# EAGLE design board-beta.0.7 (EAGLE 7.7.0)
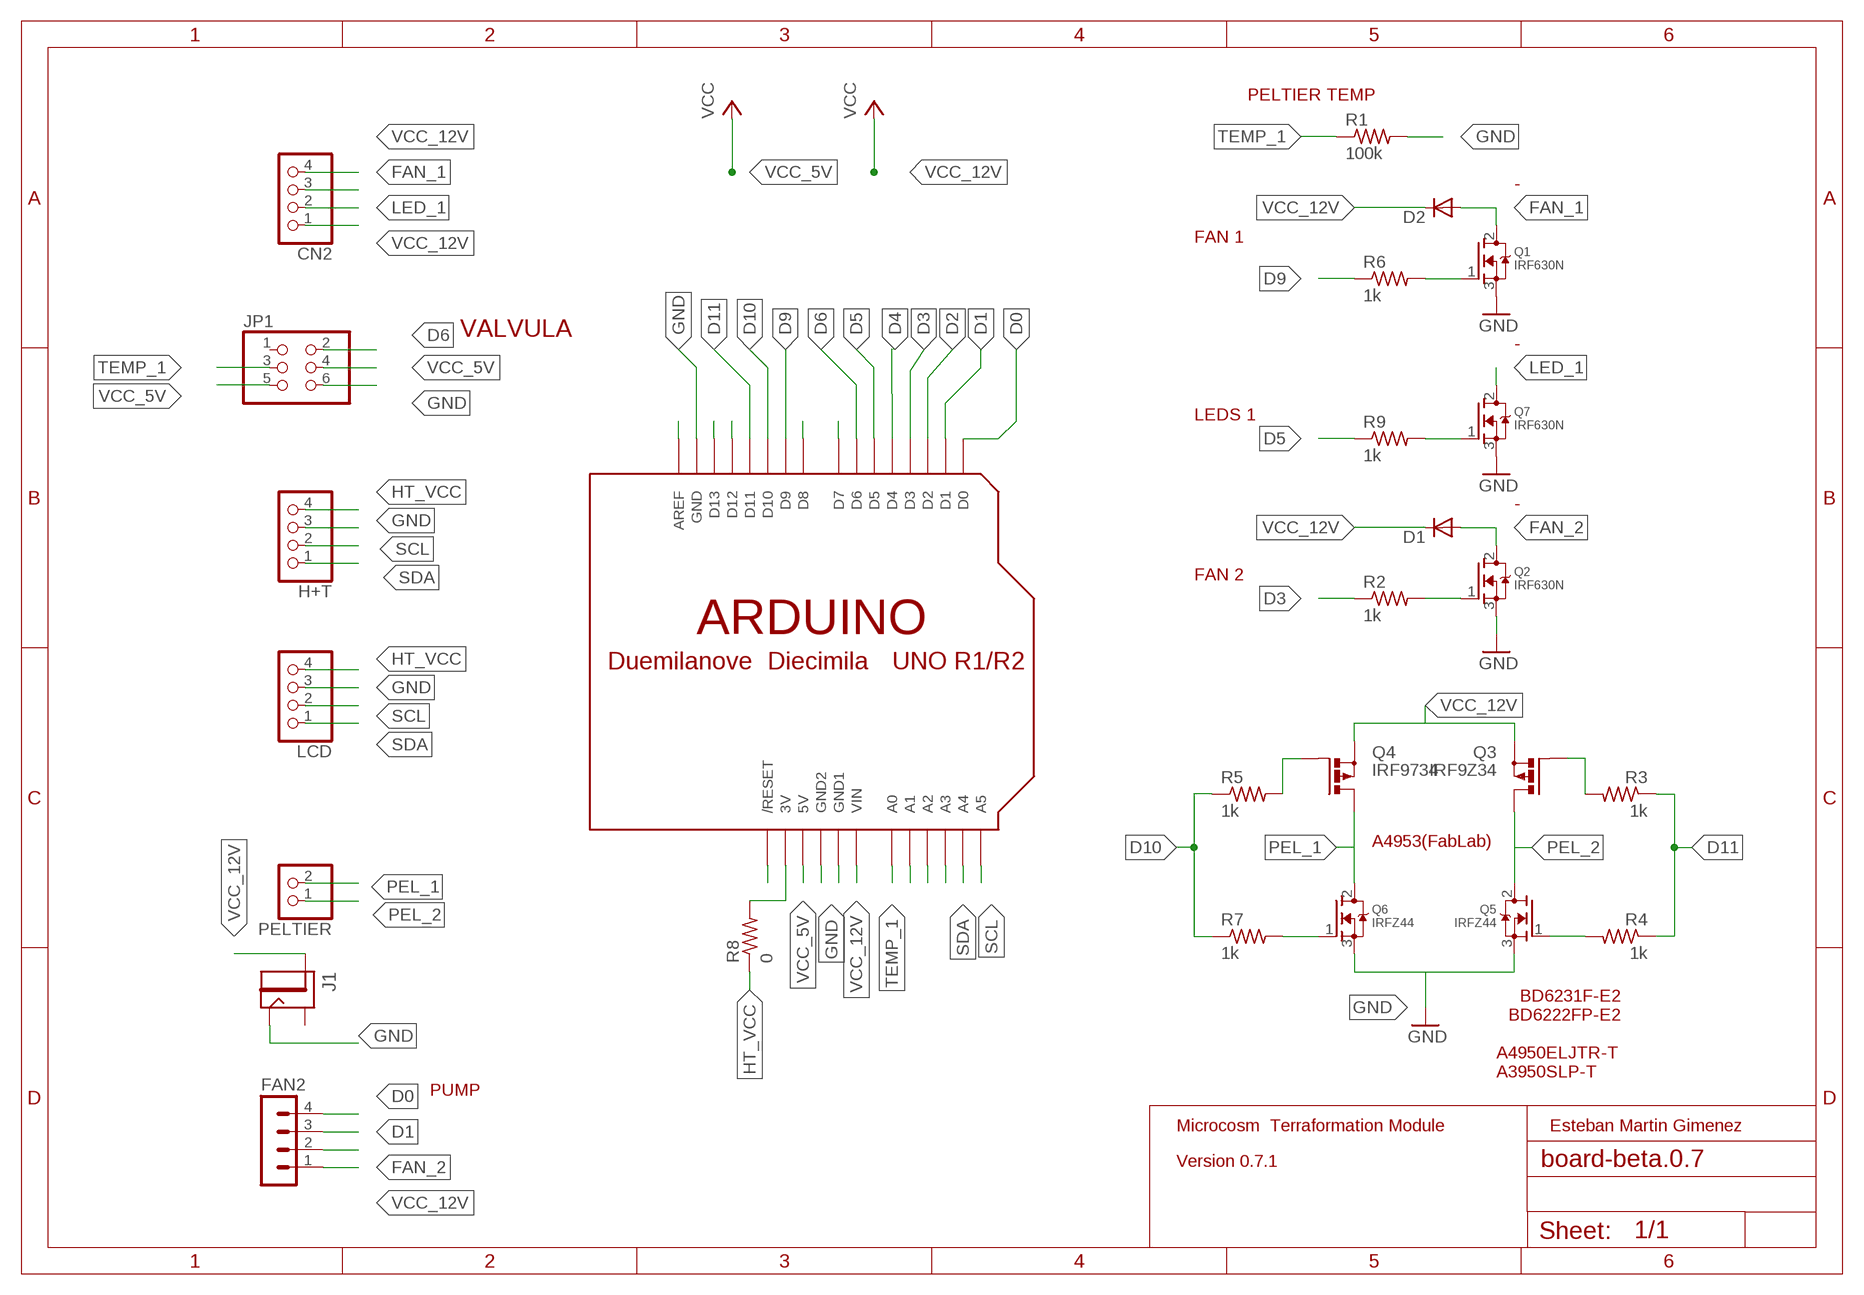
[diagram p0: schematic, sheet 1]

## Parts
CN2  PINHD-1X4  [1X04]
D1  DIODESOD123  [SOD123]
D2  DIODESOD123  [SOD123]
FAN2  MA04-1  [MA04-1]
H+T  PINHD-1X4  [1X04]
J1  JACK2.1MM  [JACK_2.1MM]
JP1  PINHD-2X3-SMD  [2X03SMD]
LCD  PINHD-1X4  [1X04]
PELTIER  PINHD-1X2  [1X02]
Q1  IRF630N  MOSFET-NGDS_TO220V  [TO220V]
Q2  IRF630N  MOSFET-NGDS_TO220V  [TO220V]
Q3  IRF9Z34  PMOSFET_PTO220BV  [TO220BV]
Q4  IRF9734  PMOSFET_PTO220BV  [TO220BV]
Q5  IRFZ44  MOSFET-NGDS_TO220V  [TO220V]
Q6  IRFZ44  MOSFET-NGDS_TO220V  [TO220V]
Q7  IRF630N  MOSFET-NGDS_TO220V  [TO220V]
R1  100k  RES-US1206FAB  [R1206FAB]
R2  1k  RES-US1206FAB  [R1206FAB]
R3  1k  RES-US1206FAB  [R1206FAB]
R4  1k  RES-US1206FAB  [R1206FAB]
R5  1k  RES-US1206FAB  [R1206FAB]
R6  1k  RES-US1206FAB  [R1206FAB]
R7  1k  RES-US1206FAB  [R1206FAB]
R8  0  RES-US1206FAB  [R1206FAB]
R9  1k  RES-US1206FAB  [R1206FAB]
U$1  ARDUINOUNO  [ARDUINO]

## Nets
D0: FAN2.4 U$1.D0
D1: FAN2.3 U$1.D1
D2: U$1.D2
D3: R2.1 U$1.D3
D4: U$1.D4
D5: R9.1 U$1.D5
D6: JP1.2 U$1.D6
D9: R6.1 U$1.D9
D10: R5.1 R7.1 U$1.D10
D11: R3.1 R4.1 U$1.D11
FAN_1: CN2.3 D2.ANODE(A) Q1.2(D)
FAN_2: D1.ANODE(A) FAN2.2 Q2.2(D)
GND: H+T.3 J1.CONTACT JP1.6 LCD.3 Q1.3(S) Q2.3(S) Q5.3(S) Q6.3(S) Q7.3(S) R1.2 U$1.GND U$1.GND2
HT_VCC: H+T.4 LCD.4 R8.1
LED_1: CN2.2 Q7.2(D)
N$1: Q1.1(G) R6.2
N$3: Q4.G R5.2
N$4: U$1.D8
N$5: Q3.G R3.2
N$7: R8.2 U$1.3V
N$8: U$1.D7
N$9: Q5.1(G) R4.2
N$10: Q6.1(G) R7.2
N$11: Q2.1(G) R2.2
N$12: Q7.1(G) R9.2
N$13: U$1.D12
N$14: U$1.D13
N$16: U$1.AREF
N$19: U$1.A3
N$20: U$1.A2
N$21: U$1.A1
N$24: U$1.GND1
N$28: U$1.RESET(/RESET)
PEL_1: PELTIER.2 Q4.D Q6.2(D)
PEL_2: PELTIER.1 Q3.D Q5.2(D)
SCL: H+T.2 LCD.2 U$1.A5
SDA: H+T.1 LCD.1 U$1.A4
TEMP_1: JP1.3 R1.1 U$1.A0
VCC_5V: JP1.4 JP1.5 U$1.5V ; supply symbol labelled VCC
VCC_12V: CN2.1 CN2.4 D1.CATHODE(C) D2.CATHODE(C) FAN2.1 J1.PIN Q3.S Q4.S U$1.VIN ; supply symbol labelled VCC
Unconnected: J1.SHUNT JP1.1

## Notes on the sheet
- PELTIER TEMP
- -
- FAN 1
- VALVULA
- -
- LEDS 1
- -
- FAN 2
- A4953(FabLab)
- BD6231F-E2
  BD6222FP-E2
- PUMP
- A4950ELJTR-T
  A3950SLP-T
- Microcosm  Terraformation Module | Esteban Martin Gimenez
- Version 0.7.1

## Library data of the parts
CN2 H+T LCD = pinhead:PINHD-1X4: PIN HEADER
D1 D2 = fab:DIODE: DIODE high speed (Philips)
FAN2 = con-lstb:MA04-1: PIN HEADER; OC_FARNELL: unknown; OC_NEWARK: unknown
J1 = fab:JACK
JP1 = fab:PINHD-2X3-SMD: PIN HEADER
PELTIER = pinhead:PINHD-1X2: PIN HEADER
Q1 Q2 Q5-Q7 = adafruit:MOSFET-N: N-Channel Mosfet 2N7002E - 60V 260mA SOT23 [Digikey: 2N7002ET1GOSTR-ND] - REEL BSH103 - 30V 850mA SOT23 [Digikey: 568-5013-1-ND]
Q3 Q4 = transistor-power:PMOSFET_P: Power MOSFET P-Channel
R1-R9 = fab:RES-US: Resistor (US Symbol) Variants with postfix FAB are widened to allow the routing of internal traces
U$1 = adafruit:ARDUINO: Arduino Diecimila/Duemilanove Make a shield with ease, this package has all the named pins as well as the two mounting drill holes and an outline of the USB and DC power connector. The outline is on the DIMENSION layer, so if your board house uses it they will cut the outline to match. http://www.ladyada.net/library/pcb/eaglelibrary.html

## Board
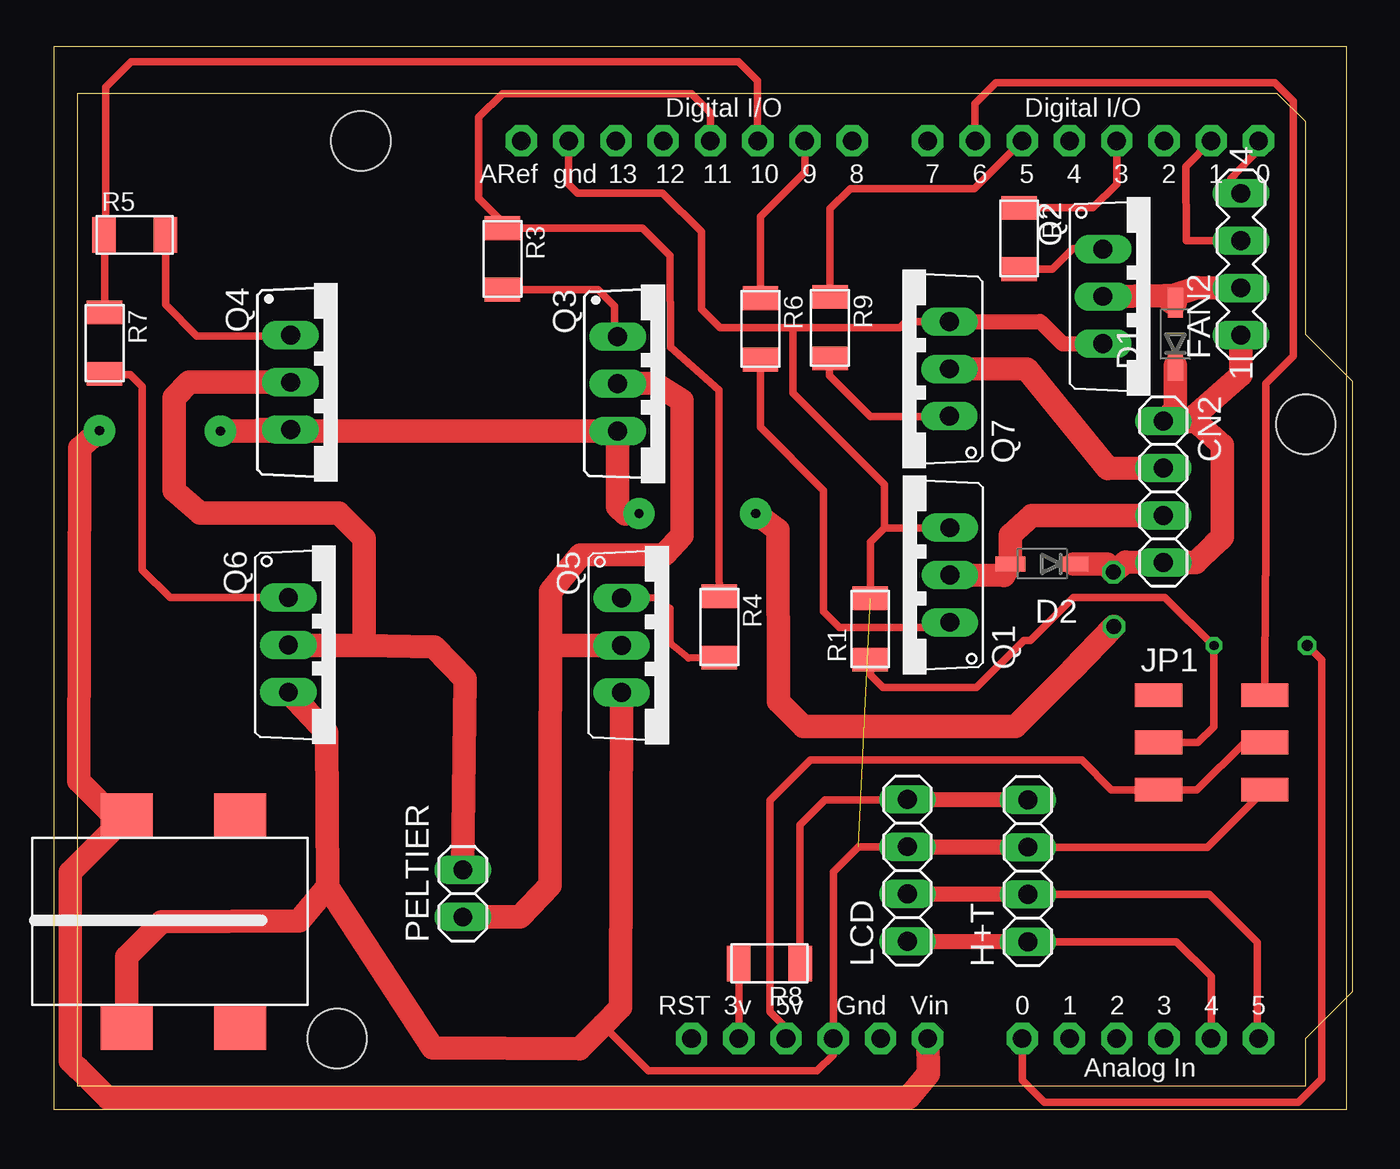
[diagram p1: board, top side]
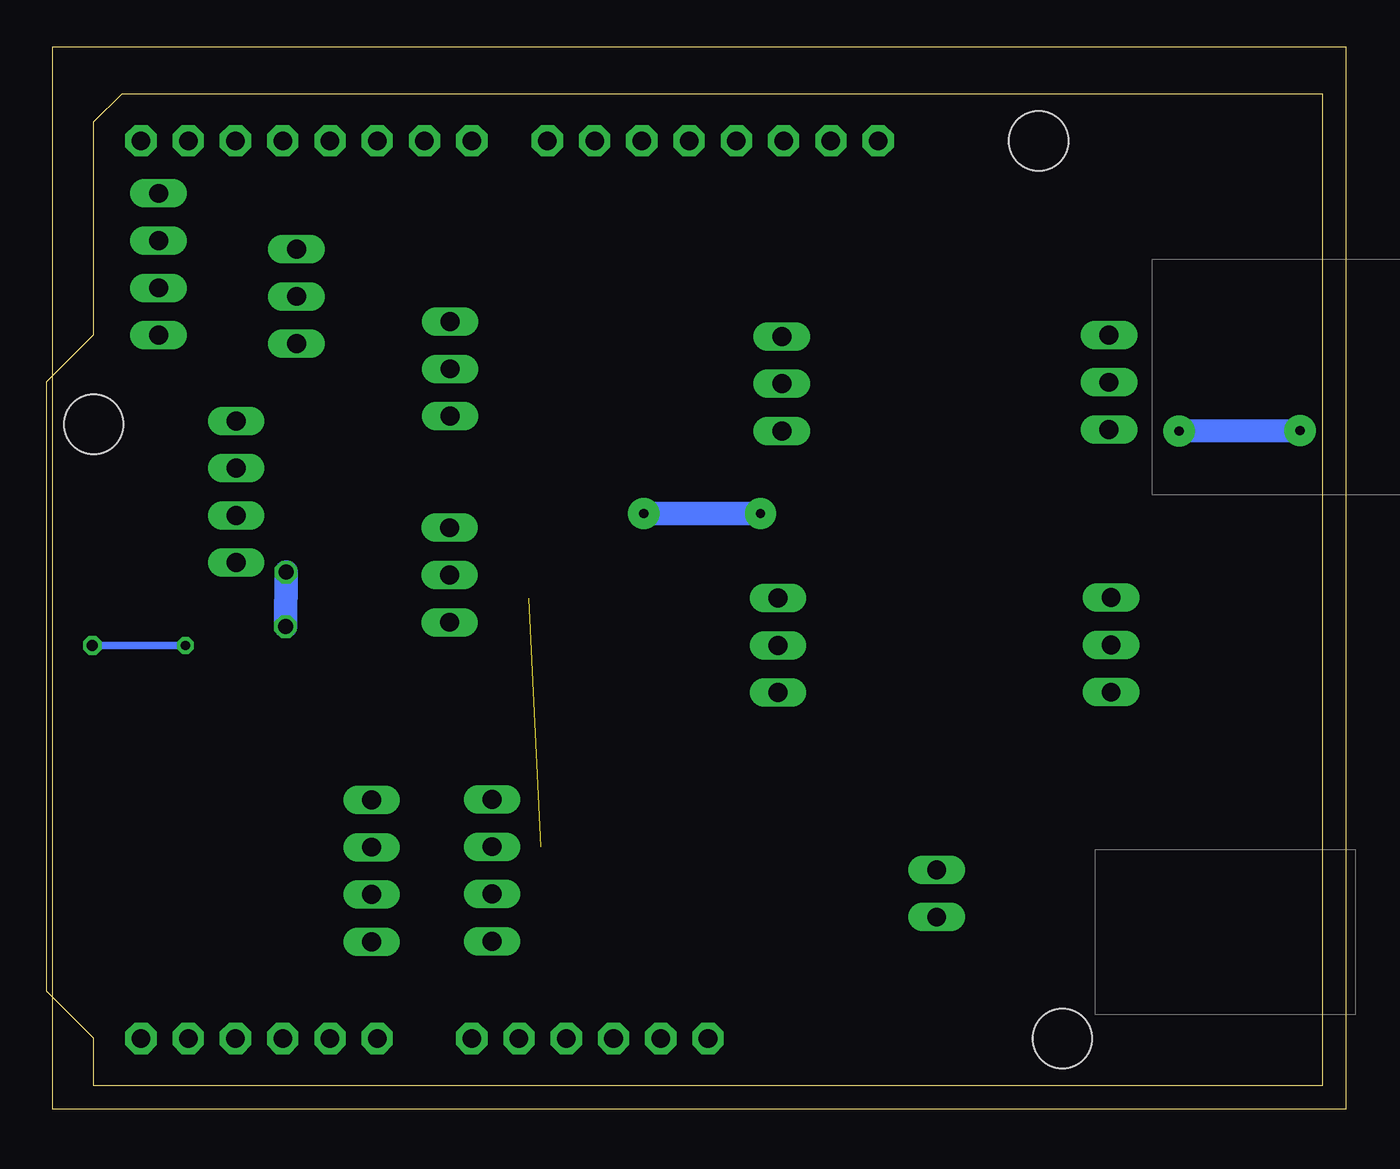
[diagram p2: board, bottom side, seen from below]

Size 69.52 x 57.14 mm. Coordinates in mm from the lower left corner, seen from the top.
Outline: 0,0 69.52,0 69.52,57.14 0,57.14 0,0
Copper layers (1*16): Top 0.035mm / dielectric 1.5mm / Bottom 0.035mm
Design rules "board12_1_3_5v": minimum track width 10mil, minimum drill 24mil, track to track 16mil, track to pad 0.205mm, pad to pad 0.205mm, via to via 0.205mm, smd to smd 6mil, copper to edge 40mil, drill to drill 8mil, minimum pad ring 10mil, minimum via ring 8mil, stop-mask expansion 4mil, vias tented up to drill 0mil, thermal gap 10mil

### Footprints (pad centres in the part's own frame; a part is rotated, then mirrored left to right if it is on the bottom)
1X04 = drill 1.016 long: 1 -3.81,0; 2 -1.27,0; 3 1.27,0; 4 3.81,0
SOD123 = smd 1.6 x 0.8: ANODE 1.7,0; CATHODE -1.7,0
MA04-1 = drill 1.016 long: 1 -3.81,0; 2 -1.27,0; 3 1.27,0; 4 3.81,0
JACK_2.1MM = smd 2.388 x 2.794: CONTACT 5.766,-2.413; PIN -5.639,-2.413; PIN1 -5.639,3.683; SHUNT 5.766,3.683
2X03SMD = smd 2.54 x 1.27: 1 -2.857,2.54; 2 2.857,2.54; 3 -2.857,0; 4 2.857,0; 5 -2.857,-2.54; 6 2.857,-2.54
1X02 = drill 1.016 long: 1 -1.27,0; 2 1.27,0
TO220V = drill 1.016 long: 1 -2.54,-2.54; 2 0,-2.54; 3 2.54,-2.54
TO220BV = drill 1.016 long: D 0,-2.54; G -2.54,-2.54; S 2.54,-2.54
R1206FAB = smd 1.27 x 1.905: 1 -1.651,0; 2 1.651,0
ARDUINO = drill 1 pad 1.676 octagon: 3V 35.56,2.54; 5V 38.1,2.54; A0 50.8,2.54; A1 53.34,2.54; A2 55.88,2.54; A3 58.42,2.54; A4 60.96,2.54; A5 63.5,2.54; AREF 23.876,50.8; D0 63.5,50.8; D1 60.96,50.8; D2 58.42,50.8; D3 55.88,50.8; D4 53.34,50.8; D5 50.8,50.8; D6 48.26,50.8; D7 45.72,50.8; D8 41.656,50.8; D9 39.116,50.8; D10 36.576,50.8; D11 34.036,50.8; D12 31.496,50.8; D13 28.956,50.8; GND 26.416,50.8; GND1 43.18,2.54; GND2 40.64,2.54; RESET 33.02,2.54; VIN 45.72,2.54 | hole 3.2: 15.24,50.8; 66.04,35.56; 13.97,2.54

### Placement (x,y rotation side)
CN2  59.66,33.2 270 top
D1  60.3,41.67 90 top
D2  53.14,29.33 180 top
FAN2  63.83,45.43 90 top
H+T  52.37,12.83 90 top
J1  6.35,10.16 270 top
JP1  62.25,19.73 0 top
LCD  45.9,12.85 90 top
PELTIER  22,11.61 90 top
Q1  45.64,28.73 90 top
Q2  58.95,43.7 270 top
Q3  32.86,39.01 270 top
Q4  15.27,39.09 270 top
Q5  33.07,24.94 270 top
Q6  15.16,24.97 270 top
Q7  45.62,39.81 90 top
R1  43.9,25.82 90 top
R2  51.9,46.82 270 top
R3  24.13,45.72 270 top
R4  35.79,25.93 270 top
R5  4.36,47.02 0 top
R6  38,41.96 270 top
R7  2.74,41.19 270 top
R8  38.48,7.85 180 top
R9  41.74,42.02 270 top
U$1  1.27,1.27 0 top

### Tracks (layer width: path | path; a pad name or v marks a point on that pad's centre or on a via)
D0
  Top 0.406: FAN2.4 63.27,50.03 64.77,51.6 64.77,51.69 U$1.D0
D1
  Top 0.406: FAN2.3 60.88,46.7 60.86,50.69 U$1.D1
D3
  Top 0.406: R2.1 55.87,48.47 57.15,49.75 U$1.D3
D5
  Top 0.406: R9.1 41.74,48.41 42.82,49.5 49.5,49.5 U$1.D5
D6
  Top 0.406: JP1.2 65.13,28.57 65.18,28.8 65.18,39.03 66.65,40.51 66.65,54.19 65.65,55.19 50.65,55.19 49.53,54.07 U$1.D6
D9
  Top 0.406: R6.1 38,48 40.38,50.38 U$1.D9
D10
  Top 0.406: R7.1 2.74,46.98 R5.1 2.79,47.1 2.79,54.96 4.17,56.33 36.83,56.33 37.85,55.31 U$1.D10
D11
  Top 0.406: U$1.D11 35.31,53.59 34.29,54.61 24.13,54.61 22.85,53.33 22.85,48.99 24.13,47.71 R3.1 31.66,47.37 33.15,45.89 33.17,40.99 35.76,38.68 35.76,29.11 R4.1
FAN_1
  Top 1.27: Q1.2 51.09,28.7 D2.ANODE 51.44,30.88 52.58,31.92 60.32,31.92 60.35,31.95 59.67,31.95 CN2.3
FAN_2
  Top 1.27: Q2.2 59.74,43.75 | 59.74,43.75 60.17,43.76 61.49,44.19 FAN2.2 | D1.ANODE 60.11,43.37 59.74,43.75
GND  (1 unrouted)
  Top 0.406: R1.2 43.9,30.5 44.65,31.26 | 44.65,31.26 Q1.3 | U$1.GND 27.69,49.75 28.17,49.27 32.74,49.27 34.82,47.19 34.82,43.02 35.81,42.03 39.8,42.03 | Q7.3 45.81,42.35 45.49,42.03 39.8,42.03 | 44.65,31.26 44.65,33.6 39.75,38.5 39.75,41.98 39.8,42.03 | LCD.3 45.89,14.11 43.25,14.11 41.91,12.77 U$1.GND2 41.91,2.94 41.05,2.07 31.98,2.07 29.53,4.53 | H+T.3 62.02,14.1 JP1.6
  Top 0.813: Q7.3 53.04,42.35 54.23,41.16 Q2.3 | LCD.3 52.35,14.12 H+T.3
  Top 1.27: J1.CONTACT 3.94,8.2 5.82,10.08 13.21,10.13 14.73,11.96 | 14.73,11.96 14.68,20.27 Q6.3 | Q5.3 30.48,5.48 29.53,4.53 28.27,3.27 20.37,3.32 14.73,11.96
HT_VCC
  Top 0.406: R8.1 40.13,15.29 41.48,16.63 45.86,16.63 LCD.4
  Top 0.813: LCD.4 52.35,16.66 H+T.4
LED_1
  Top 1.27: Q7.2 48.95,39.82 52.33,39.81 56.68,34.45 CN2.2
N$1
  Top 0.406: R6.2 38,36.69 41.38,33.27 41.38,26.76 42.24,25.9 47.9,25.9 Q1.1
N$3
  Top 0.406: R5.2 6.01,43.26 7.69,41.57 12.68,41.57 Q4.G
N$5
  Top 0.406: Q3.G 30.15,41.72 30.15,43.19 29.27,44.07 R3.2
N$7
  Top 0.406: U$1.3V 36.88,4.11 36.85,4.04 R8.2
N$9
  Top 0.406: Q5.1 32.41,27.51 33.15,26.92 33.15,25.06 34.14,24.27 R4.2
N$10
  Top 0.406: Q6.1 6.26,27.51 4.77,29 4.77,38.85 4.11,39.51 2.77,39.51 R7.2
N$11
  Top 0.406: R2.2 53.68,45.17 54.79,46.27 56.39,46.27 Q2.1
N$12
  Top 0.406: R9.2 41.71,39.45 43.92,37.25 48.14,37.25 Q7.1
PEL_1
  Top 1.27: PELTIER.2 22.12,23.13 20.45,24.86 16.69,24.93 | 16.69,24.93 12.66,24.93 Q6.2 | Q4.D 7.29,39.09 6.48,38.27 6.48,33.27 7.87,32.07 15.32,32.07 16.69,30.7 16.69,24.93
PEL_2
  Top 1.27: Q5.2 26.75,24.94 26.72,24.83 | 26.72,24.83 26.72,24.68 26.7,18.15 26.7,12.03 25.08,10.36 PELTIER.1 | Q3.D 32.28,39.04 33.78,38.12 33.78,30.85 32.84,29.84 28.32,29.81 26.72,27.83 26.72,24.83
SCL
  Top 0.406: H+T.2 62.12,11.56 64.69,8.98 64.69,3.89 U$1.A5
  Top 0.813: LCD.2 52.35,11.58 H+T.2
SDA
  Top 0.406: H+T.1 60.37,9.02 62.23,7.15 U$1.A4
  Top 0.813: LCD.1 52.35,9.04 H+T.1
TEMP_1  (via drill 0.5 pad 0.61, 0.6)
  Top 0.406: R1.1 43.9,23.35 44.58,22.67 49.6,22.67 52.14,25.21 52.5,25.21 54.81,27.53 59.74,27.53 62.36,24.91 | 62.36,24.91 62.36,20.57 61.52,19.73 JP1.3 | U$1.A0 52.07,1.57 53.26,0.37 66.9,0.37 68.17,1.64 68.17,24.15 v67.38,24.93 | v62.38,24.93 62.36,24.91
  Bottom 0.406: v67.38,24.93 v62.38,24.93
VCC_5V
  Top 0.406: JP1.4 64.03,19.73 61.47,17.16 59.89,17.16 | 59.89,17.16 59.42,17.16 JP1.5 | U$1.5V 39.37,4.38 38.51,5.25 38.51,16.6 40.69,18.79 55.27,18.79 56.87,17.19 59.87,17.19 59.89,17.16
VCC_12V  (via drill 0.5 pad 1.68, 0.8)
  Top 1.27: v31.47,32.03 30.73,32 30.32,32.42 Q3.S 11.02,36.47 | v37.74,32.03 38.94,31.14 38.96,21.92 40.31,20.57 51.69,20.57 54.71,23.6 v57,25.96 | U$1.VIN 47.02,1.92 45.96,0.61 8.35,0.59 2.93,0.59 1.32,2.2 1.3,2.2 0.89,2.61 0.89,12.75 3.58,15.44 | CN2.1 59.57,36.97 61.39,36.97 62.81,35.7 62.81,30.78 62.38,30.34 62.36,30.34 61.4,29.39 CN2.4 57.63,29.41 v56.97,28.88 56.62,29.33 D2.CATHODE | FAN2.1 63.83,39.49 61.11,37.08 60.08,37.02 CN2.1 | 3.58,15.44 J1.PIN | 11.02,36.47 v8.96,36.47 | v2.47,36.49 1.4,35.55 1.34,17.67 3.58,15.44 | Q4.S 11.1,36.55 11.02,36.47 | D1.CATHODE 60.3,37.65 CN2.1
  Bottom 1.27: v31.47,32.03 v37.74,32.03 | v57,25.96 v56.97,28.88 | v8.96,36.47 v2.47,36.49